# Altium schematic sheet 01_Power.SchDoc
size 420 x 297 mm; PageSetup: Record=PageOptions|CenterHorizontal=True|CenterVertical=True|PrintScale=0.94|XCorrection=1.00|YCorrection=1.00|PrintKind=1|BorderSize=5000000|LeftOffset=0|BottomOffset=0|Orientation=1|PaperLength=1000|PaperWidth=1000|Scale=100|PaperSource=7|PrintQuality=-4|MediaType=1|DitherType=10|PaperKind=A4|PrintScaleMode=1; DecimalNumber: Децимальный номер; HeadOfSector: Нач. сектора; MainDevice: Перв.примен.; Name: PicoLimitSwitchShield — Power; Наименование2: PicoLimitSwitchShield — Power; Author: ALTIUM GOSTBOM2.0 KEV; SheetNumber: 1; SheetTotal: 2; Sheet_No: 1; Sheet_all: 2
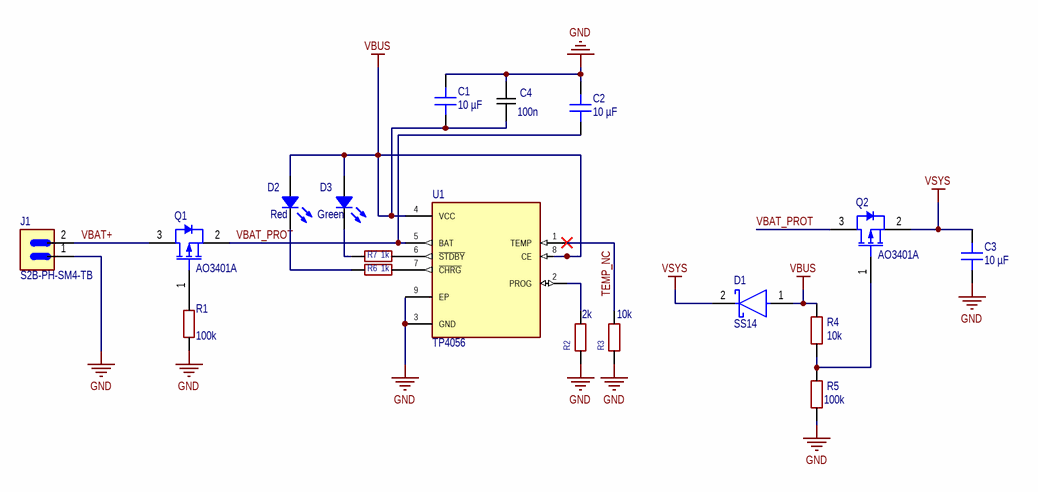
[diagram p0: 01_Power.SchDoc]

## Parts
C1  10 µF  [CAP 0603_1608]
C2  10 µF  [CAP 0603_1608]
C3  10 µF  [CAP 0603_1608]
C4  100n  [CAPC1608(0603)N]
D1  SS14  [FP-403AE-MFG]
D2  Red  [LED 0603_1608 RED]
D3  Green  [LED 0603_1608 GREEN]
J1  S2B-PH-SM4-TB  [JST_S2B-PH-SM4-TB]
Q1  AO3401A  [AO-SOT-23-3L_V]
Q2  AO3401A  [AO-SOT-23-3L_V]
R1  100k  [RESC1608(0603)N]
R2  2k  [REZKemet 0402]
R3  10k  [RESC1608(0603)N]
R4  10k  [RESC1608(0603)N]
R5  100k  [RESC1608(0603)N]
R6  1k  [RESC1608(0603)N]
R7  1k  [RESC1608(0603)N]
U1  TP4056  [SOP127P600X175-9N]

## Nets
GND: C1.1 C2.1 C3.2 C4.2 J1.1 R1.1 R2.1 R3.1 R5.1 U1.3(GND)
VBUS: C1.2 C4.1 D1.1(A) D2.1 D3.1 R4.2 U1.4(VCC) U1.8(CE)
VSYS: C3.1 D1.2(C) Q2.2(SOURCE)
TEMP_NC: R3.2 U1.1(TEMP)
VBAT+: J1.2 Q1.3(DRAIN)
VBAT_PROT: C2.2 Q1.2(SOURCE) Q2.3(DRAIN) U1.5(BAT)
NetD2_2: D2.2 R6.1
NetD3_2: D3.2 R7.1
NetQ1_1: Q1.1(GATE) R1.2
NetQ2_1: Q2.1(GATE) R4.1 R5.2
NetR2_2: R2.2 U1.2(PROG)
NetR6_2: R6.2 U1.7(~{CHRG})
NetR7_2: R7.2 U1.6(~{STDBY})

Not connected (* = marked no-connect by the designer): U1 9(EP)

## Notes on the sheet
- Перв. примен.
- Справ. №
- Подп. дата
- Инв. № дубл.
- Взам. инв. №
- Подп. и дата
- Изм.
- Разраб.
- Лист
- № докум.
- Подп.
- Дата
- Лит.
- Масса
- Масштаб
- Пров.
- Т.контр.
- Листов
- Инв. № подл.
- Н.контр.
- Утв.
- ALTIUM GOSTBOM2.0 KEV
- Файл:
- Копировал
- Формат А3

## Library data of the parts
C1-C3 = GRM188C81A106MA73D: CAP CER 10UF 10V X6S 0603; manufacturer: Murata Electronics; Tolerance: ±20%; Part Number: GRM188C81A106MA73D; Capacitance: 10 µF; Applications: General Purpose; componentlink1description: Datasheet; componentlink1url: https://www.murata.com/~/media/webrenewal/support/library/catalog/products/capacitor/mlcc/c02e.ashx?la=en-us; componentlink2description: DigiKey Link; componentlink2url: https://www.digikey.com/en/products/detail/murata-electronics/GRM188C81A106MA73D/3900461; Device Package: 0603 (1608 Metric); lastupdated: 06.04.2026 19:23:51; Lifecycle Status: Active; Minimum Order: 1; Mounting Type: Surface Mount, MLCC; Operating Temperature: -55°C ~ 105°C; Package / Case: 0603 (1608 Metric); packaging: TapeAndReel; partid: 2456; Part Status: Active; price: 0.04; series: GRM; Size / Dimension: 0.063" L x 0.031" W (1.60mm x 0.80mm); Supplier 1: DigiKey; Supplier Part Number 1: 490-7197-1-ND; Temperature Coefficient: X6S; Thickness (Max): 0.039" (1.00mm); value: 10 µF; Voltage - Rated: 10V
C4 = UMF107B7104MAHT: 0,1uF 0603 50V X7R  +/-20%; Part Number: UMF107B7104MAHT; HelpURL: https://www.mouser.com/ProductDetail/Taiyo-Yuden/UMF107B7104MAHT?qs=%252B6g0mu59x7IXaZoRIc0z4w%3D%3D; Price$: 0.043; Manufacturer Part Number: UMF107B7104MAHT; Package: 0603; Mouser Part Number: 963-UMF107B7104MAHT
D1 = CMP-2000-04943-2: DIODE SCHOTTKY 40V 1A SMA; Manufacturer: ON Semiconductor; Peak Reverse Current: 0.2mA; Max Junction Temp: +125°C; Standoff Height: 0.05mm; Max Surge Forward Current: 40A; Mouser Description: Schottky Diodes & Rectifiers SMA 40V 1.0A; RoHS: TRUE; Lead Free: Yes; Manufacturer Part Number: SS14; Device Class L3: Schottky Diodes; Category: Diode; Automotive: No; Digikey Description: DIODE SCHOTTKY 40V 1A SMA; ComponentLink2Description: Datasheet; Device Class L2: Diodes; Height: 2.5mm; Temperature Range High: +125°C; ComponentLink2URL: https://www.onsemi.com/pub/Collateral/SS19-D.PDF; Device Class L1: Discrete Semiconductors; Package: 403AE; Octopart: https://octopart.com/ss14-on+semiconductor-29205033; Max Repetitive Reverse Voltage: 40V; Temperature Range Low: -65°C; Forward Current: 1A; Temperature: -65°C to +125°C
D2 = QBLP601-R: LED RED CLEAR 0603 SMD; Manufacturer: QT Brightek (QTB); Configuration: Standard; Current - Test: 20mA; Lens Color: Colorless; Lens Size: 1.10mm x 0.80mm; Lens Style: Rectangle with Flat Top; Millicandela Rating: 100mcd; Viewing Angle: 140°; Voltage - Forward (Vf) (Typ): 2V; Wavelength - Dominant: 625nm; Wavelength - Peak: 640nm; Part Number: QBLP601-R; Color: Red; ComponentLink1Description: Datasheet; ComponentLink1URL: http://www.qt-brightek.com/datasheet/QBLP601_series.pdf; ComponentLink2Description: DigiKey Link; ComponentLink2URL: https://www.digikey.com/en/products/detail/qt-brightek-qtb/QBLP601-R/4814657; Device Package: 0603 (1608 Metric); Height (Max): 0.60mm; LastUpdated: 05.04.2026 20:38:00; Lens Transparency: Clear; Lifecycle Status: Active; Minimum Order: 1; Mounting Type: Surface Mount; Package / Case: 0603 (1608 Metric); Packaging: TapeAndReel; PartId: 383; Part Status: Active; Price: 0.06; Series: QBLP601; Size / Dimension: 1.60mm L x 0.80mm W; Supplier 1: DigiKey; Supplier Part Number 1: 1516-1059-1-ND; Supplier Device Package: 0603; Value: Red
D3 = QTLP601C4TR: LED GREEN CLEAR 0603 SMD; Manufacturer: Everlight Electronics Co Ltd; Configuration: Standard; Current - Test: 20mA; Lens Color: Colorless; Lens Size: 1.20mm x 0.80mm; Lens Style: Rectangle with Flat Top; Millicandela Rating: 15mcd; Viewing Angle: 120°; Voltage - Forward (Vf) (Typ): 2.1V; Wavelength - Dominant: 570nm; Wavelength - Peak: 565nm; Part Number: QTLP601C4TR; Color: Green; ComponentLink1Description: Datasheet; ComponentLink1URL: //media.digikey.com/pdf/Data%20Sheets/Everlight%20PDFs/QTLP601C-2,3,4,7,B.pdf; ComponentLink2Description: DigiKey Link; ComponentLink2URL: https://www.digikey.com/en/products/detail/everlight-electronics-co-ltd/QTLP601C4TR/2675896; Device Package: 0603 (1608 Metric); Height (Max): 0.60mm; LastUpdated: 05.04.2026 20:36:38; Lens Transparency: Clear; Lifecycle Status: Active; Minimum Order: 1; Mounting Type: Surface Mount; Package / Case: 0603 (1608 Metric); Packaging: TapeAndReel; PartId: 584; Part Status: Active; Price: 0.05; Series: -; Size / Dimension: 1.60mm L x 0.80mm W; Supplier 1: DigiKey; Supplier Part Number 1: 1080-1405-1-ND; Supplier Device Package: 0603; Value: Green
J1 = S2B-PH-SM4-TB: Connector Header Surface Mount, Right Angle 2 position 0.079 (2.00mm); MF: JST Sales; SnapEDA_Link: https://www.snapeda.com/parts/S2B-PH-SM4-TB/JST/view-part/?ref=snap; Package: None; Value: *; MP: S2B-PH-SM4-TB; Check_prices: https://www.snapeda.com/parts/S2B-PH-SM4-TB/JST/view-part/?ref=eda
Q1 Q2 = CMP-2000-05778-1: P-Channel MOSFET, 30 V, 4 A, -55 to 150 degC, 3-Pin SOT-23-3L, RoHS, Tape and Reel; Manufacturer: Alpha and Omega; Output Power (Max): NotRequiredW; Power Dissipation: 1.4W; Rad Hardened: No; Drain Efficiency: NotRequired%; Drain-Source On-Volt: 30V; Noise Figure: NotRequireddB; Frequency (Max): NotRequiredMHz; Number of  Elements: 1; Gate-Source Voltage (Max): ?12V; Drain Current (Max): 4A; Channel Mode: Enhancement; Drain-Source On-Res: 0.044ohm; Type: PowerMOSFET; Polarity: P; Package URL: http://www.aosmd.com/res/packaging_information/SOT-23-3L.pdf; Datasheet URL: http://www.aosmd.com/res/data_sheets/AO3401A.pdf; Package Type: SOT-23; Package Description: 3-Pin Small Outline Transistor, Body 2.95 x 1.6 mm, Pitch 0.95 mm; Mounting: SurfaceMount; Manufacturer URL: http://www.aosmd.com/; Continuous Drain Current: 4A; Package Reference: SOT-23-3L; Mounting Technology: SurfaceMount; Operating Temperature Classification: Military; Power Gain: NotRequireddB; Datasheet Version: Rev. 3, 03/2011; Operating Temp Range: -55Cto150C; Pin Count: 3
R1 = CRCW0603100KFKEAC: RES SMD 0603 100k 1% 100ppm; Part Number: CRCW0603100KFKEAC; HelpURL: https://www.digikey.com/en/products/detail/vishay-dale/CRCW0603100KFKEAC/7928372?s=N4IgTCBcDaIMICU4HUAMA2VBmAjK1A0gGIECiAgnCALoC%2BQA; Price$: 0.005; Manufacturer Part Number: CRCW0603100KFKEAC; Package: 0603; Mouser Part Number: 71-CRCW0603100KFKEAC
R2 = RC0402JR-072KL: RES SMD 0402 2k 5% 100ppm; Part Number: RC0402JR-072KL; HelpURL: https://www.digikey.com/en/products/detail/yageo/RC0402JR-072KL/726434; Digi-Key Part Number: 311-2.0KJRCT-ND; Price$: 0.00233; Manufacturer Part Number: RC0402JR-072KL; Package: 0402
R3 R4 = RC0603FR-0710KL: RES SMD 0603 10k 1% 100ppm; Note: Backorder; Part Number: RC0603FR-0710KL; HelpURL: https://eu.mouser.com/ProductDetail/Yageo/RC0603FR-0710KL?qs=grNVn54RoB%252B3GtjbJj3wJQ%3D%3D; Manufacturer Part Number: RC0603FR-0710KL; Package: 0603; Mouser Part Number: 603-RC0603FR-0710KL
R5 = RT0603DRE07100KL: RES SMD 0603 100k 0.5% 50ppm; Part Number: RT0603DRE07100KL; HelpURL: https://eu.mouser.com/ProductDetail/Yageo/RT0603DRE07100KL?qs=sGAEpiMZZMvdGkrng054t1nmr2c61WvadC66rbrHowc%3D; Price$: 0.016; Manufacturer Part Number: RT0603DRE07100KL; Package: 0603; Mouser Part Number: 603-RT0603DRE07100KL
R6 R7 = RT0603DRE071KL: RES SMD 0603 1.00k 0.5% 50ppm; Part Number: RT0603DRE071KL; HelpURL: https://eu.mouser.com/ProductDetail/Yageo/RT0603DRE071KL?qs=sGAEpiMZZMvdGkrng054t1nmr2c61WvafBArSy4TrV4%3D; Manufacturer Part Number: RT0603DRE071KL; Package: 0603; Mouser Part Number: 603-RT0603DRE071KL
U1 = TP4056: Complete single cell Li-Ion battery with a constant current / constant voltage linear charger; MF: NanJing Top Power ASIC Corp.; Check_prices: https://www.snapeda.com/parts/TP4056/NanJing+Top+Power+ASIC+Corp./view-part/?ref=eda; SnapEDA_Link: https://www.snapeda.com/parts/TP4056/NanJing+Top+Power+ASIC+Corp./view-part/?ref=snap; Price: None; Availability: Not in stock; Package: Package; MP: TP4056; Value: *